# Altium schematic sheet io_TS.SchDoc
size A4
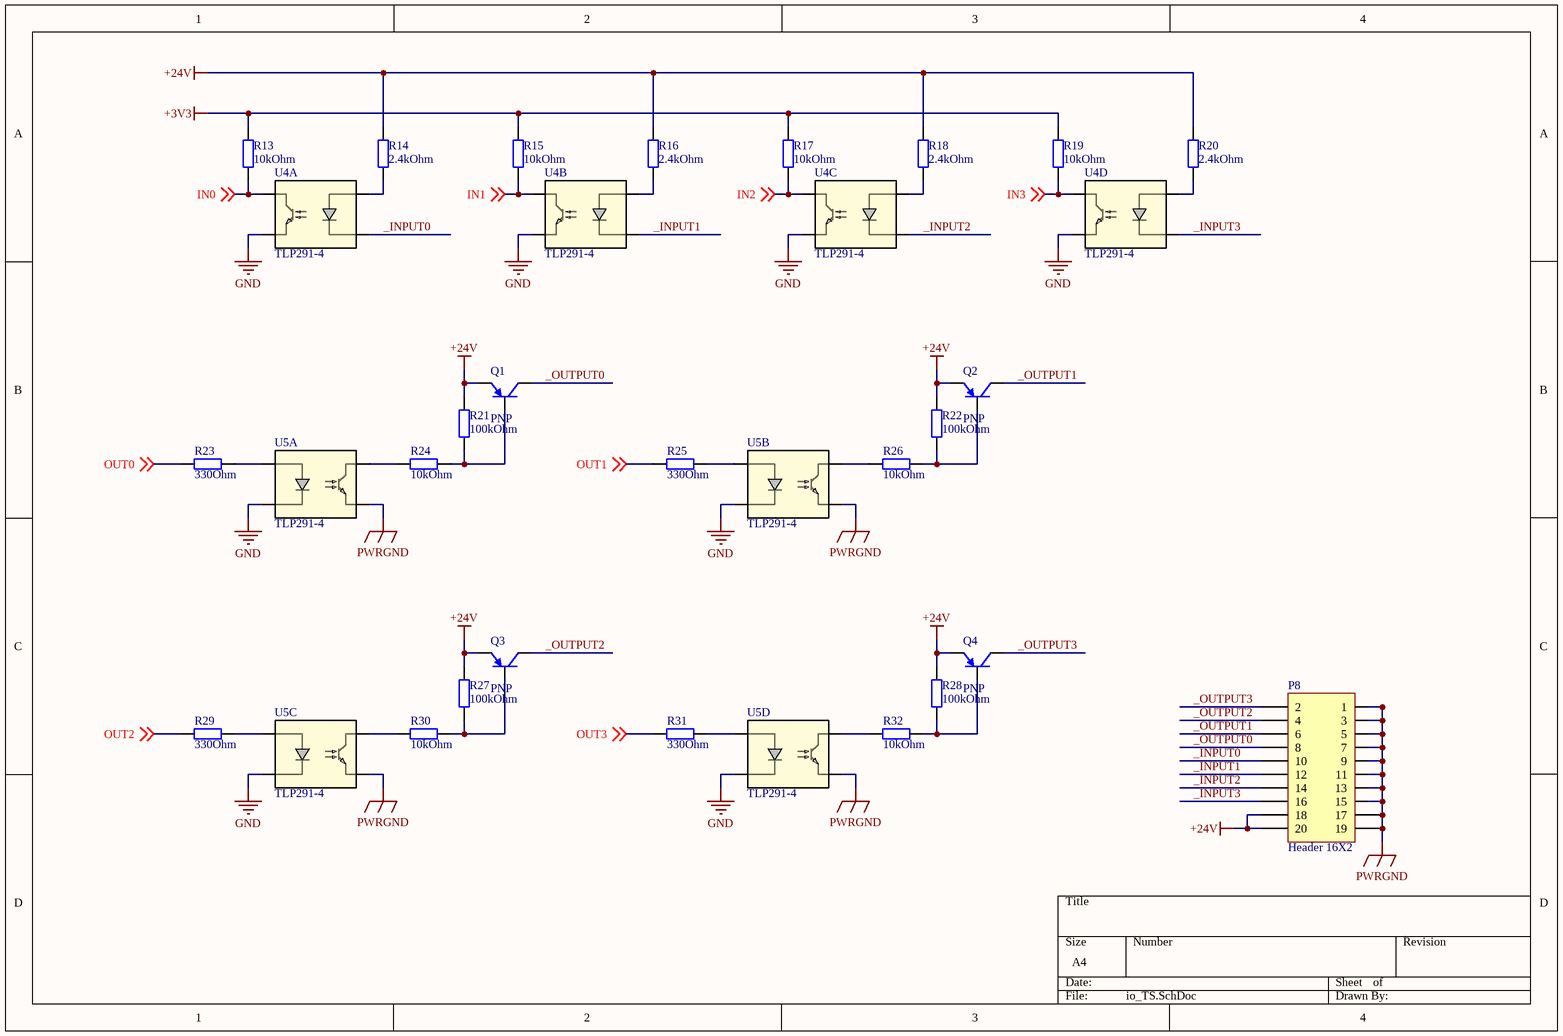
[diagram p0: io_TS.SchDoc]

## Parts
P8  Header 16X2  [MOLEX 505448-2071]
Q1  PNP  [SOT-89]
Q2  PNP  [SOT-89]
Q3  PNP  [SOT-89]
Q4  PNP  [SOT-89]
R13  value 10kOhm  [RES 0805]  (hidden comment: Resistor)
R14  value 2.4kOhm  [RES 0805]  (hidden comment: Resistor)
R15  value 10kOhm  [RES 0805]  (hidden comment: Resistor)
R16  value 2.4kOhm  [RES 0805]  (hidden comment: Resistor)
R17  value 10kOhm  [RES 0805]  (hidden comment: Resistor)
R18  value 2.4kOhm  [RES 0805]  (hidden comment: Resistor)
R19  value 10kOhm  [RES 0805]  (hidden comment: Resistor)
R20  value 2.4kOhm  [RES 0805]  (hidden comment: Resistor)
R21  value 100kOhm  [RES 0805]  (hidden comment: Resistor)
R22  value 100kOhm  [RES 0805]  (hidden comment: Resistor)
R23  value 330Ohm  [RES 0805]  (hidden comment: Resistor)
R24  value 10kOhm  [RES 0805]  (hidden comment: Resistor)
R25  value 330Ohm  [RES 0805]  (hidden comment: Resistor)
R26  value 10kOhm  [RES 0805]  (hidden comment: Resistor)
R27  value 100kOhm  [RES 0805]  (hidden comment: Resistor)
R28  value 100kOhm  [RES 0805]  (hidden comment: Resistor)
R29  value 330Ohm  [RES 0805]  (hidden comment: Resistor)
R30  value 10kOhm  [RES 0805]  (hidden comment: Resistor)
R31  value 330Ohm  [RES 0805]  (hidden comment: Resistor)
R32  value 10kOhm  [RES 0805]  (hidden comment: Resistor)
U4  TLP291-4  [SO-16]  (parts A,B,C,D of 4)
U5  TLP291-4  [SO-16]  (parts A,B,C,D of 4)

## Nets
+3V3: R13.2 R15.2 R17.2 R19.2
+24V: P8.18 P8.20 Q1.2(E) Q2.2(E) Q3.2(E) Q4.2(E) R14.2 R16.2 R18.2 R20.2 R21.2 R22.2 R27.2 R28.2
GND: U4.9 U4.11 U4.13 U4.15 U5.2 U5.4 U5.6 U5.8
PWRGND: P8.1 P8.3 P8.5 P8.7 P8.9 P8.11 P8.13 P8.15 P8.17 P8.19 U5.9 U5.11 U5.13 U5.15
_INPUT0: P8.10 U4.2
_INPUT1: P8.12 U4.4
_INPUT2: P8.14 U4.6
_INPUT3: P8.16 U4.8
_OUTPUT0: P8.8 Q1.3(C)
_OUTPUT1: P8.6 Q2.3(C)
_OUTPUT2: P8.4 Q3.3(C)
_OUTPUT3: P8.2 Q4.3(C)
IN0: R13.1 U4.16 ; off-sheet IN0
IN1: R15.1 U4.14 ; off-sheet IN1
IN2: R17.1 U4.12 ; off-sheet IN2
IN3: R19.1 U4.10 ; off-sheet IN3
OUT0: R23.2 ; off-sheet OUT0
OUT1: R25.2 ; off-sheet OUT1
OUT2: R29.2 ; off-sheet OUT2
OUT3: R31.2 ; off-sheet OUT3
NetQ1_1: Q1.1(B) R21.1 R24.1
NetQ2_1: Q2.1(B) R22.1 R26.1
NetQ3_1: Q3.1(B) R27.1 R30.1
NetQ4_1: Q4.1(B) R28.1 R32.1
NetR14_1: R14.1 U4.1
NetR16_1: R16.1 U4.3
NetR18_1: R18.1 U4.5
NetR20_1: R20.1 U4.7
NetR23_1: R23.1 U5.1
NetR24_2: R24.2 U5.16
NetR25_1: R25.1 U5.3
NetR26_2: R26.2 U5.14
NetR29_1: R29.1 U5.5
NetR30_2: R30.2 U5.12
NetR31_1: R31.1 U5.7
NetR32_2: R32.2 U5.10

## Library data of the parts
P8 = Header 10X2: Header, 32-Pin; LatestRevisionDate: 17-Jul-2002; LatestRevisionNote: Re-released for DXP Platform.; Publisher: Altium Limited
Q1-Q4 = PNP: PNP Bipolar Transistor (for SOT23-3 only).; pin to pad: 2>3 3>2; Published: 8-Jun-2000; LatestRevisionDate: 29-May-2009; LatestRevisionNote: IPC-7351 Footprint Added.; PackageVersion: Aug-1999; PackageReference: SOT-23B; Publisher: Altium Limited; PackageDescription: 3-Pin SOT-23 Package 0.95 mm Pitch, 2.4 mm Lead Span
R13-R32 = Res: Published: 8-Jun-2000; LatestRevisionDate: 17-Jul-2002; LatestRevisionNote: Re-released for DXP Platform.; PackageReference: AXIAL-0.4; Publisher: Altium Limited; PackageDescription: Axial Device, Thru-Hole; 2 Leads; 0.4 in Pin Spacing
U4 U5 = TLP291-4: No Description Available; Vendor: Toshiba; SourceLibrary: Toshiba_2019-02-06; Source_Package: TLP291_4; Number_devices_in_Package: 1; Copyright: Copyright (C) 2018 Accelerated Designs. All rights reserved; Manufacturer_Part_Number: TLP291-4; RefDes: RefDes; Type: DEV